# Altium schematic sheet ATmega324PB_Xplained_Pro_Connectors.SchDoc: Extension connectors
size A3; Organization: ATMEL Norway; Address1: Vestre Rosten 79; Address2: N-7075 TILLER; Address3: NORWAY; DocumentNumber: A09-2589; Revision: 1; SheetNumber: 4; SheetTotal: 5; PageSetup: Record=PageOptions|CenterHorizontal=True|CenterVertical=True|PrintScale=1.01|XCorrection=1.00|YCorrection=1.00|PrintKind=1|BorderSize=5000000|LeftOffset=0|BottomOffset=0|Orientation=2|PaperLength=1000|PaperWidth=1000|Scale=100|PaperSource=7|PrintQuality=-4|MediaType=1|DitherType=10|PaperKind=A3 (297 x 420 mm)|PrintScaleMode=1
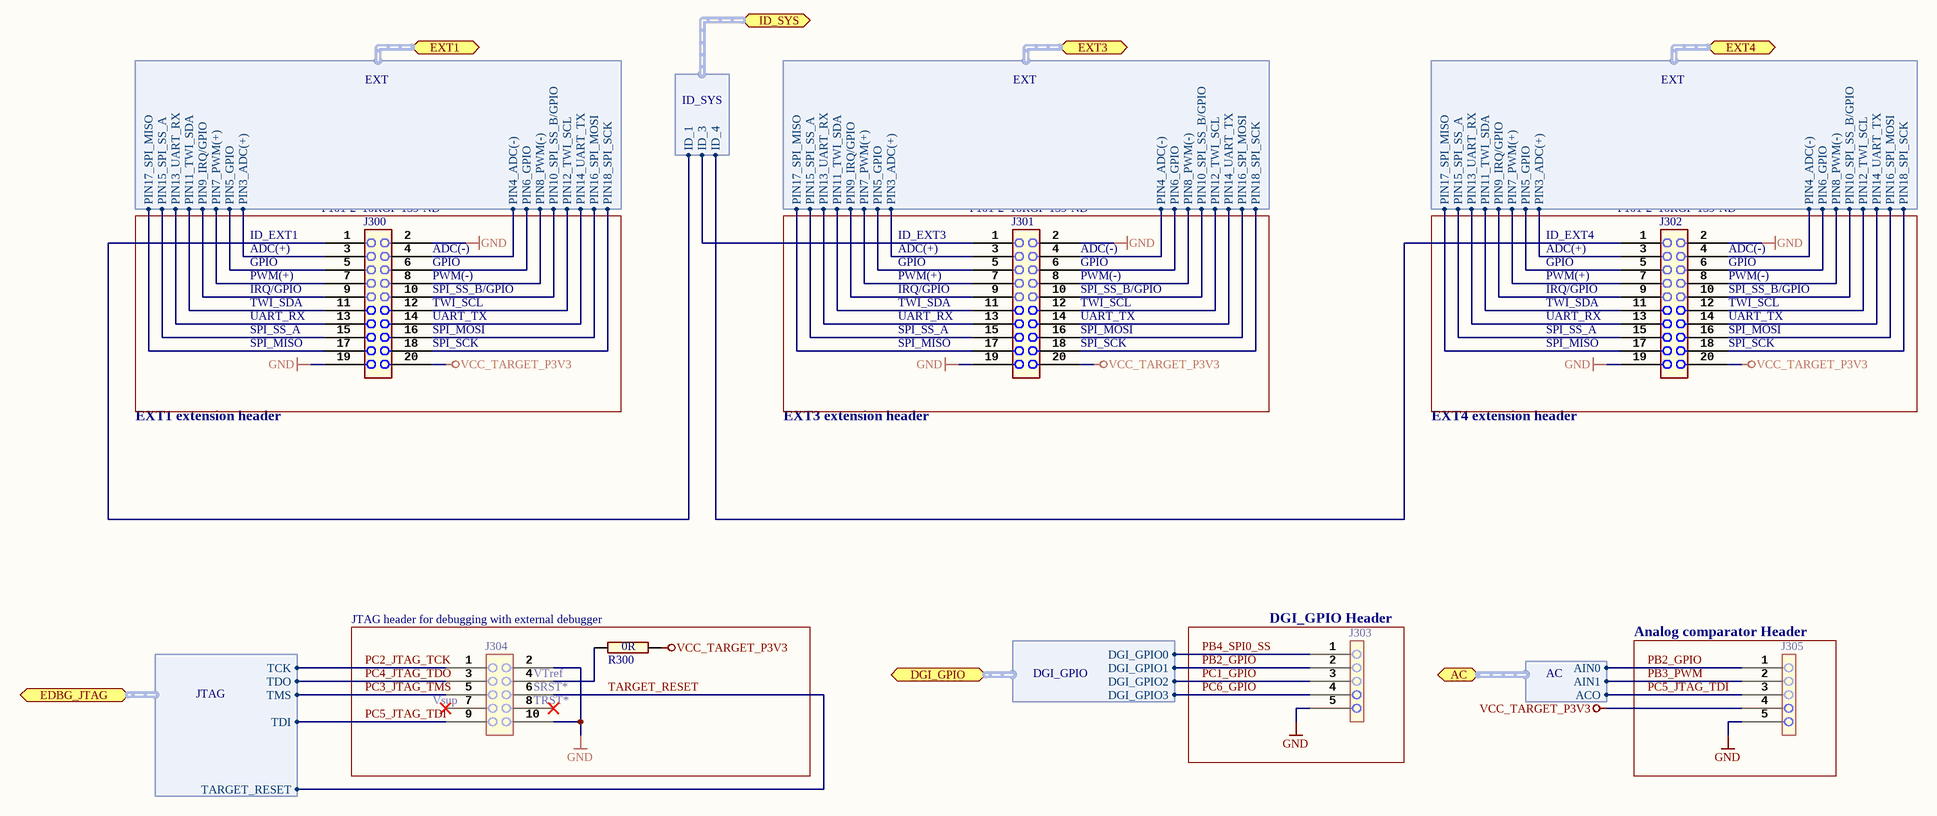
[diagram p0: ATmega324PB_Xplained_Pro_Connectors.SchDoc]

## Parts
J300  value P101-2*10RGF-139-ND  [AP8-00622]
J301  value P101-2*10RGF-139-ND  [AP8-00622]
J302  value P101-2*10RGF-139-ND  [AP8-00622]
J303  (no value)  [AP8-00968]
J304  (no value)  [AP8-00257]
J305  (no value)  [AP8-00968]
R300  value 0R  [AP2-00000]

## Blocks framed on the sheet
DGI_GPIO Header: J303
Analog comparator Header: J305

## Ports
AC (harness AC), DGI_GPIO (harness DGI_GPIO), EDBG_JTAG (harness JTAG), EXT1 (harness EXT), EXT3 (harness EXT), EXT4 (harness EXT), ID_SYS (harness ID_SYS)

## Harnesses
ID_SYS: ID_1, ID_3, ID_4
EXT: PIN3_ADC(+), PIN4_ADC(-), PIN5_GPIO, PIN6_GPIO, PIN7_PWM(+), PIN8_PWM(-), PIN9_IRQ/GPIO, PIN10_SPI_SS_B/GPIO, PIN11_TWI_SDA, PIN12_TWI_SCL, PIN13_UART_RX, PIN14_UART_TX, PIN15_SPI_SS_A, PIN16_SPI_MOSI, PIN17_SPI_MISO, PIN18_SPI_SCK
DGI_GPIO: DGI_GPIO0, DGI_GPIO1, DGI_GPIO2, DGI_GPIO3
AC: AIN1, AIN0, ACO
JTAG: TCK, TDI, TDO, TMS, TARGET_RESET

## Nets
GND: J300.2 J300.19 J301.2 J301.19 J302.2 J302.19 J303.5 J304.2 J304.10 J305.5
VCC_TARGET_P3V3: J300.20 J301.20 J302.20 J305.4 R300.2
PB2_GPIO: J303.2 J305.1 ; port DGI_GPIO.DGI_GPIO1, port AC.AIN0
PB3_PWM: J305.2 ; port AC.AIN1
PB4_SPI0_SS: J303.1 ; port DGI_GPIO.DGI_GPIO0
PC1_GPIO: J303.3 ; port DGI_GPIO.DGI_GPIO2
PC2_JTAG_TCK: J304.1 ; port EDBG_JTAG.TCK
PC3_JTAG_TMS: J304.5 ; port EDBG_JTAG.TMS
PC4_JTAG_TDO: J304.3 ; port EDBG_JTAG.TDO
PC5_JTAG_TDI: J304.9 J305.3 ; port AC.ACO, port EDBG_JTAG.TDI
PC6_GPIO: J303.4 ; port DGI_GPIO.DGI_GPIO3
TARGET_RESET: J304.6 ; port EDBG_JTAG.TARGET_RESET
NetJ300_1: J300.1 ; port ID_SYS.ID_1
NetJ300_3: J300.3 ; port EXT1.PIN3_ADC(+)
NetJ300_4: J300.4 ; port EXT1.PIN4_ADC(-)
NetJ300_5: J300.5 ; port EXT1.PIN5_GPIO
NetJ300_6: J300.6 ; port EXT1.PIN6_GPIO
NetJ300_7: J300.7 ; port EXT1.PIN7_PWM(+)
NetJ300_8: J300.8 ; port EXT1.PIN8_PWM(-)
NetJ300_9: J300.9 ; port EXT1.PIN9_IRQ/GPIO
NetJ300_10: J300.10 ; port EXT1.PIN10_SPI_SS_B/GPIO
NetJ300_11: J300.11 ; port EXT1.PIN11_TWI_SDA
NetJ300_12: J300.12 ; port EXT1.PIN12_TWI_SCL
NetJ300_13: J300.13 ; port EXT1.PIN13_UART_RX
NetJ300_14: J300.14 ; port EXT1.PIN14_UART_TX
NetJ300_15: J300.15 ; port EXT1.PIN15_SPI_SS_A
NetJ300_16: J300.16 ; port EXT1.PIN16_SPI_MOSI
NetJ300_17: J300.17 ; port EXT1.PIN17_SPI_MISO
NetJ300_18: J300.18 ; port EXT1.PIN18_SPI_SCK
NetJ301_1: J301.1 ; port ID_SYS.ID_3
NetJ301_3: J301.3 ; port EXT3.PIN3_ADC(+)
NetJ301_4: J301.4 ; port EXT3.PIN4_ADC(-)
NetJ301_5: J301.5 ; port EXT3.PIN5_GPIO
NetJ301_6: J301.6 ; port EXT3.PIN6_GPIO
NetJ301_7: J301.7 ; port EXT3.PIN7_PWM(+)
NetJ301_8: J301.8 ; port EXT3.PIN8_PWM(-)
NetJ301_9: J301.9 ; port EXT3.PIN9_IRQ/GPIO
NetJ301_10: J301.10 ; port EXT3.PIN10_SPI_SS_B/GPIO
NetJ301_11: J301.11 ; port EXT3.PIN11_TWI_SDA
NetJ301_12: J301.12 ; port EXT3.PIN12_TWI_SCL
NetJ301_13: J301.13 ; port EXT3.PIN13_UART_RX
NetJ301_14: J301.14 ; port EXT3.PIN14_UART_TX
NetJ301_15: J301.15 ; port EXT3.PIN15_SPI_SS_A
NetJ301_16: J301.16 ; port EXT3.PIN16_SPI_MOSI
NetJ301_17: J301.17 ; port EXT3.PIN17_SPI_MISO
NetJ301_18: J301.18 ; port EXT3.PIN18_SPI_SCK
NetJ302_1: J302.1 ; port ID_SYS.ID_4
NetJ302_3: J302.3 ; port EXT4.PIN3_ADC(+)
NetJ302_4: J302.4 ; port EXT4.PIN4_ADC(-)
NetJ302_5: J302.5 ; port EXT4.PIN5_GPIO
NetJ302_6: J302.6 ; port EXT4.PIN6_GPIO
NetJ302_7: J302.7 ; port EXT4.PIN7_PWM(+)
NetJ302_8: J302.8 ; port EXT4.PIN8_PWM(-)
NetJ302_9: J302.9 ; port EXT4.PIN9_IRQ/GPIO
NetJ302_10: J302.10 ; port EXT4.PIN10_SPI_SS_B/GPIO
NetJ302_11: J302.11 ; port EXT4.PIN11_TWI_SDA
NetJ302_12: J302.12 ; port EXT4.PIN12_TWI_SCL
NetJ302_13: J302.13 ; port EXT4.PIN13_UART_RX
NetJ302_14: J302.14 ; port EXT4.PIN14_UART_TX
NetJ302_15: J302.15 ; port EXT4.PIN15_SPI_SS_A
NetJ302_16: J302.16 ; port EXT4.PIN16_SPI_MOSI
NetJ302_17: J302.17 ; port EXT4.PIN17_SPI_MISO
NetJ302_18: J302.18 ; port EXT4.PIN18_SPI_SCK
NetJ304_4: J304.4 R300.1

Not connected (* = marked no-connect by the designer): J304 7* 8*

## Notes on the sheet
- ID_EXT1
- ADC(+)
- (near J300) ADC(-)
- ID_EXT3
- (near J301) ADC(-)
- ID_EXT4
- (near J302) ADC(-)
- GPIO
- PWM(+)
- IRQ/GPIO
- TWI_SDA
- (near J300) GPIO
- (near J300) PWM(-)
- (near J300) SPI_SS_B/GPIO
- (near J300) TWI_SCL
- (near J301) GPIO
- (near J301) PWM(-)
- (near J301) SPI_SS_B/GPIO
- (near J301) TWI_SCL
- (near J302) GPIO
- (near J302) PWM(-)
- (near J302) SPI_SS_B/GPIO
- (near J302) TWI_SCL
- UART_RX
- SPI_SS_A
- SPI_MISO
- (near J300) UART_TX
- (near J300) SPI_MOSI
- (near J300) SPI_SCK
- (near J301) UART_TX
- (near J301) SPI_MOSI
- (near J301) SPI_SCK
- (near J302) UART_TX
- (near J302) SPI_MOSI
- (near J302) SPI_SCK
- EXT1 extension header
- EXT3 extension header
- EXT4 extension header
- (near R300) JTAG header for debugging with external debugger
- (near J304) Vsup
- (near J304) VTref
- (near J304) SRST*
- (near J304) TRST*
- Date:
- PAGE:
- of
- TITLE:
- Document number:
- Revision:

## Library data of the parts
J300-J302 = A08-1513: Pin header, 2x10, Right Angle, 2.54mm, THM, Pin In Paste; PartGroup: Mechanical devices,Connectors,Pin headers; Manufacturer: Pro-data International Corp; AN: A08-1513; MPN: P101-2*10RGF-139-ND
J303 J305 = A08-2448: 1x5 pin header, 2.54mm pitch, Pin-in-Paste THM; PartGroup: Mechanical devices,Connectors,Pin headers; Manufacturer: SAMTEC; Value: HMTSW-105-23-F-S-237; TemperatureRange: - 55 deg C to + 125 deg C; AN: A08-2448; Height: 6,09999990463257; MPN: HMTSW-105-23-F-S-237
J304 = A08-0385: 2x5 pin header, 1.27mm pitch, THM; PartGroup: Mechanical devices,Connectors,Pin headers; Manufacturer: Garry; MPN: 176-2-010-0-T-XS0-0730; Value: PIN HEADER 2x5; AN: A08-0385; Height: 7,30000019073486
R300 = A02-0163: RES 0.0 OHM 1/16W 0402 SMD; PartGroup: Resistors,SMD,0402 1%; Manufacturer: (n/a); MPN: RMCF0402ZT0R00; Tolerance: 1 %; TemperatureRange: -55 - +125 deg C; AN: A02-0163; Height: 0,349999994039536